# Altium schematic sheet Accessories.SchDoc
size A4
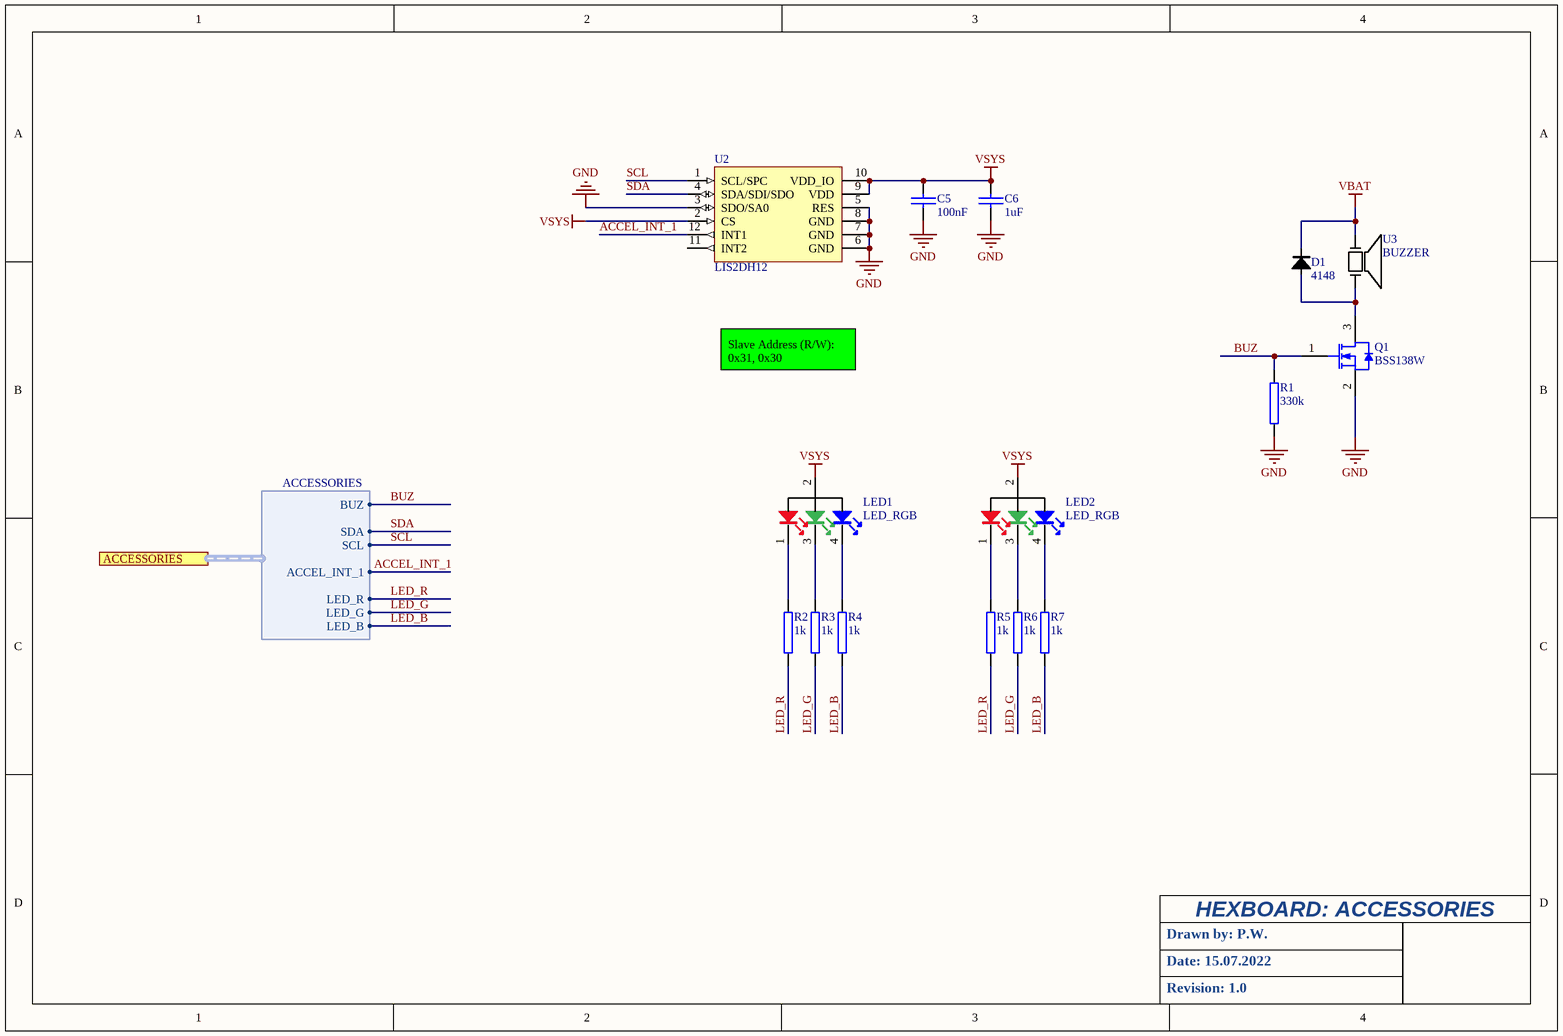
[diagram p0: Accessories.SchDoc]

## Parts
C5  100nF  [C0603L]
C6  1uF  [C0603L]
D1  4148  [0603-DIODE]
LED1  LED_RGB  [LED_604APFA3010LSEEZGKQ]
LED2  LED_RGB  [LED_604APFA3010LSEEZGKQ]
Q1  BSS138W  [SOT-323]
R1  330k  [1608[0603]]
R2  1k  [1608[0603]]
R3  1k  [1608[0603]]
R4  1k  [1608[0603]]
R5  1k  [1608[0603]]
R6  1k  [1608[0603]]
R7  1k  [1608[0603]]
U2  LIS2DH12  [LGA50P200X200X100-12N]
U3  BUZZER  [SMT28]

## Ports
ACCESSORIES (harness ACCESSORIES)

## Harnesses
ACCESSORIES: ACCEL_INT_1, LED_R, LED_G, SDA, SCL, LED_B, BUZ

## Nets
GND: C5.2 C6.2 Q1.2(S) R1.1 U2.3(SDO/SA0) U2.5(RES) U2.6(GND) U2.7(GND) U2.8(GND)
VBAT: D1.2(K) U3.2
VSYS: C5.1 C6.1 LED1.2(KG) LED2.2(KG) U2.2(CS) U2.9(VDD) U2.10(VDD_IO)
ACCEL_INT_1: U2.12(INT1) ; port ACCESSORIES.ACCEL_INT_1
BUZ: Q1.1(G) R1.2 ; port ACCESSORIES.BUZ
LED_B: R4.1 R7.1 ; port ACCESSORIES.LED_B
LED_G: R3.1 R6.1 ; port ACCESSORIES.LED_G
LED_R: R2.1 R5.1 ; port ACCESSORIES.LED_R
SCL: U2.1(SCL/SPC) ; port ACCESSORIES.SCL
SDA: U2.4(SDA/SDI/SDO) ; port ACCESSORIES.SDA
NetD1_1: D1.1(A) Q1.3(D) U3.1
NetLED1_1: LED1.1(KR) R2.2
NetLED1_3: LED1.3(KB) R3.2
NetLED1_4: LED1.4(AB) R4.2
NetLED2_1: LED2.1(KR) R5.2
NetLED2_3: LED2.3(KB) R6.2
NetLED2_4: LED2.4(AB) R7.2

Not connected (* = marked no-connect by the designer): U2 11(INT2)

## Notes on the sheet
- Slave Address (R/W): 0x31, 0x30
- HEXBOARD: ACCESSORIES
- Drawn by: P.W.
- Date: 15.07.2022
- Revision: 1.0

## Library data of the parts
C5 C6 = CAP: Capacitor
D1 = D: DIODE
LED1 LED2 = LED_RGB_2: Red/green/blue LED
Q1 = BSS138W: N-MOSFET; Manufacturer 1: -; Manufacturer 1 PartNo: -; Supplier 1: -; Supplier 1 PartNo: -
R1-R7 = RES
U2 = LIS2xx12: 3-axis - ±2g/±4g/±8g/±16g digital output femto accelerometer; Manufacturer: STMicroelectronics; 2nd source part number: 243-3081; Part number IPS: 00000007817; Note: MEMS digital output motion sensor ultra low-power high performance 3-axes "femto" accelerometer; Artikkelnr Noca: N.A.; Part Number: LIS2DH12; Manufacturer Part Number: LIS2DH12; Datasheet: http://www.st.com/st-web-ui/static/active/en/resource/technical/document/datasheet/DM00091513.pdf; Footprint Doc: LGA-12; LatestRevisionDate: 2015-09-29; Pin Count: 12; Publisher: Nordic Semiconductor; Published: 2015-09-29; Value: LIS2DH12; Supplier: Digi-Key; Supplier part number: 497-14851-1-ND; 2nd source Supplier: Farnell; Artikkelnr Simpro: N.A.